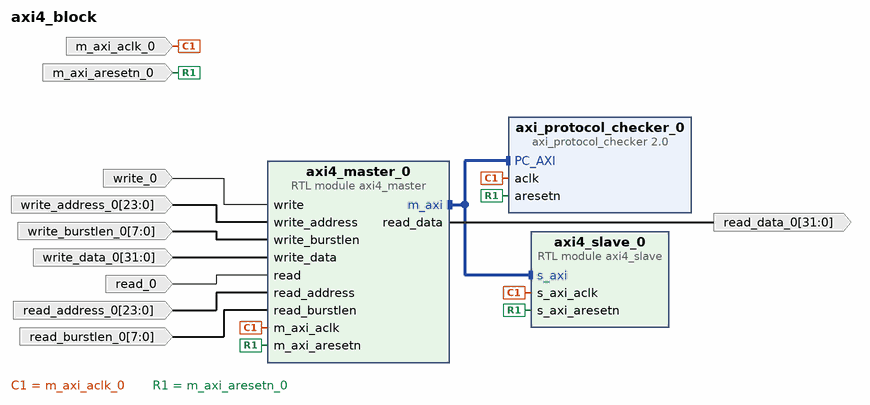
[diagram p0: block diagram of the top level]
# Vivado block design axi4_block, xc7vx485tffg1157-1, Vivado 2019.1
create_bd_design axi4_block

create_bd_port -dir I -type clk m_axi_aclk_0
create_bd_port -dir I -type rst m_axi_aresetn_0
create_bd_port -dir I write_0
create_bd_port -dir I -from 23 -to 0 write_address_0
create_bd_port -dir I -from 7 -to 0 write_burstlen_0
create_bd_port -dir I -from 31 -to 0 write_data_0
create_bd_port -dir I read_0
create_bd_port -dir I -from 23 -to 0 read_address_0
create_bd_port -dir I -from 7 -to 0 read_burstlen_0
create_bd_port -dir O -from 31 -to 0 read_data_0

create_bd_cell -type module -reference axi4_master axi4_master_0
create_bd_cell -type module -reference axi4_slave axi4_slave_0
create_bd_cell -type ip -vlnv xilinx.com:ip:axi_protocol_checker:2.0 axi_protocol_checker_0

# ---- connections ----

connect_bd_intf_net [get_bd_intf_pins axi4_slave_0/s_axi] [get_bd_intf_pins axi4_master_0/m_axi]
connect_bd_intf_net [get_bd_intf_pins axi4_slave_0/s_axi] [get_bd_intf_pins axi_protocol_checker_0/PC_AXI]
connect_bd_net -net m_axi_aclk_0_1 [get_bd_ports m_axi_aclk_0] \
  [get_bd_pins axi4_master_0/m_axi_aclk] [get_bd_pins axi4_slave_0/s_axi_aclk] [get_bd_pins axi_protocol_checker_0/aclk]
connect_bd_net -net m_axi_aresetn_0_1 [get_bd_ports m_axi_aresetn_0] \
  [get_bd_pins axi4_master_0/m_axi_aresetn] [get_bd_pins axi4_slave_0/s_axi_aresetn] \
  [get_bd_pins axi_protocol_checker_0/aresetn]
connect_bd_net -net write_0_1 [get_bd_ports write_0] [get_bd_pins axi4_master_0/write]
connect_bd_net -net write_address_0_1 [get_bd_ports write_address_0] [get_bd_pins axi4_master_0/write_address]
connect_bd_net -net write_burstlen_0_1 [get_bd_ports write_burstlen_0] [get_bd_pins axi4_master_0/write_burstlen]
connect_bd_net -net write_data_0_1 [get_bd_ports write_data_0] [get_bd_pins axi4_master_0/write_data]
connect_bd_net -net read_0_1 [get_bd_ports read_0] [get_bd_pins axi4_master_0/read]
connect_bd_net -net read_address_0_1 [get_bd_ports read_address_0] [get_bd_pins axi4_master_0/read_address]
connect_bd_net -net read_burstlen_0_1 [get_bd_ports read_burstlen_0] [get_bd_pins axi4_master_0/read_burstlen]
connect_bd_net [get_bd_pins axi4_master_0/read_data] [get_bd_ports read_data_0]

validate_bd_design
save_bd_design
